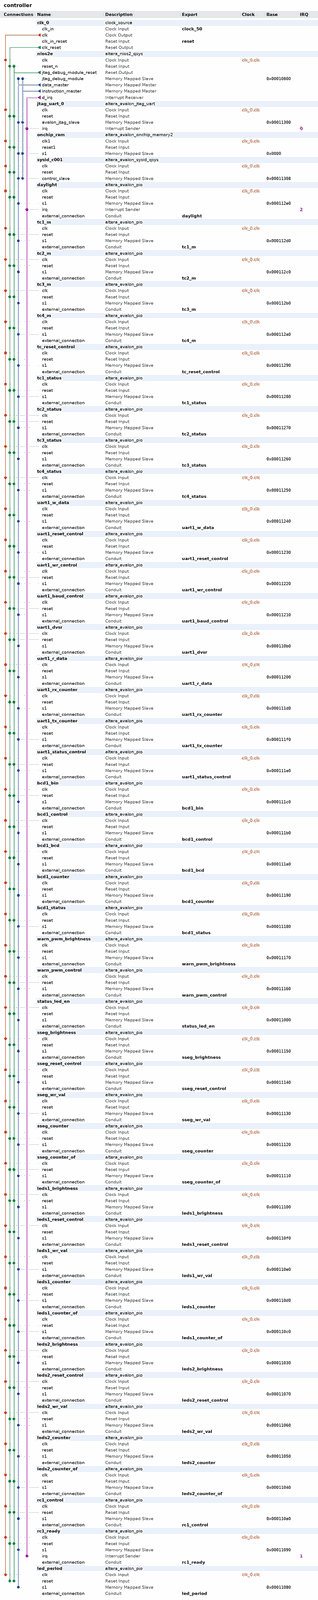
[diagram p0: system contents, whole]
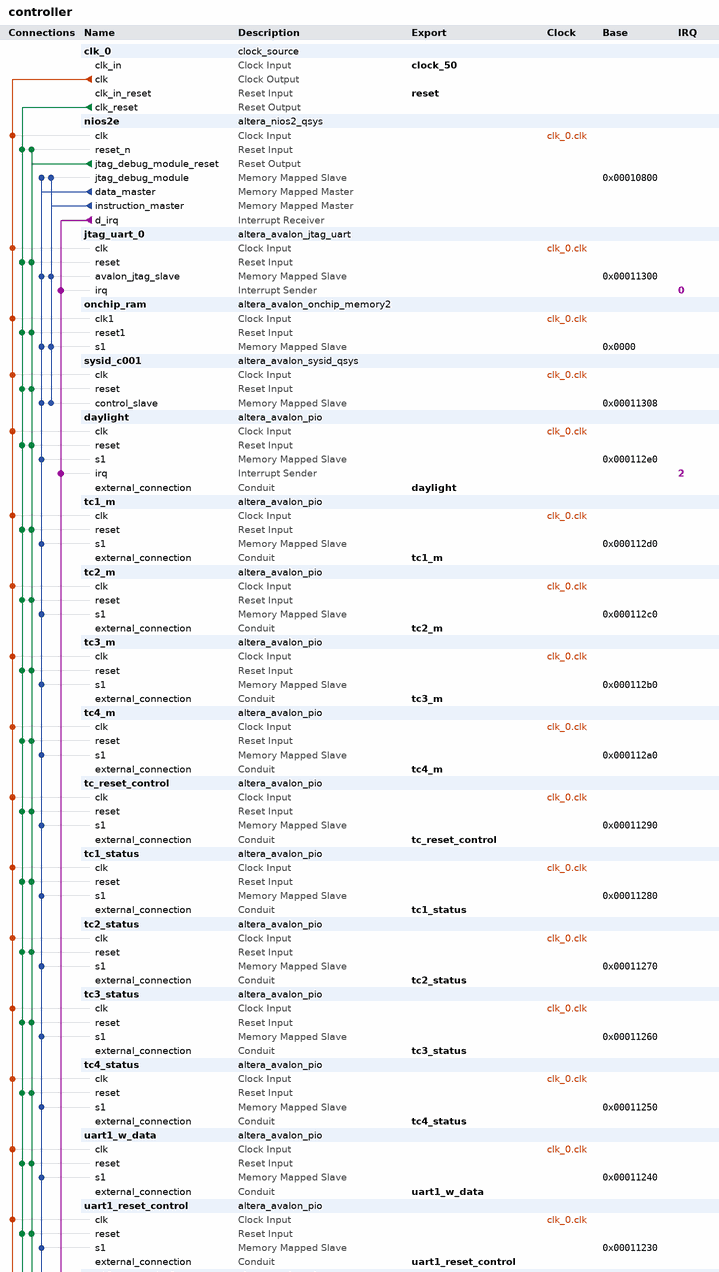
[diagram p1: system contents, upper part]
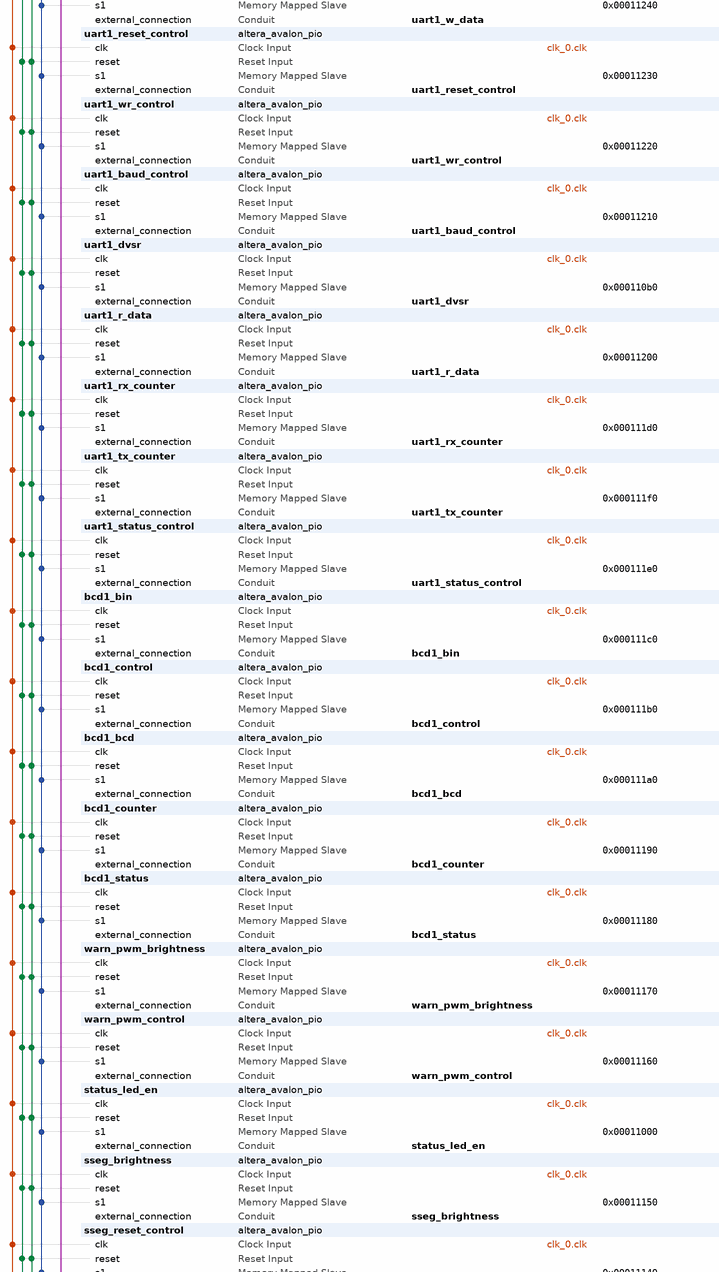
[diagram p2: system contents, middle part]
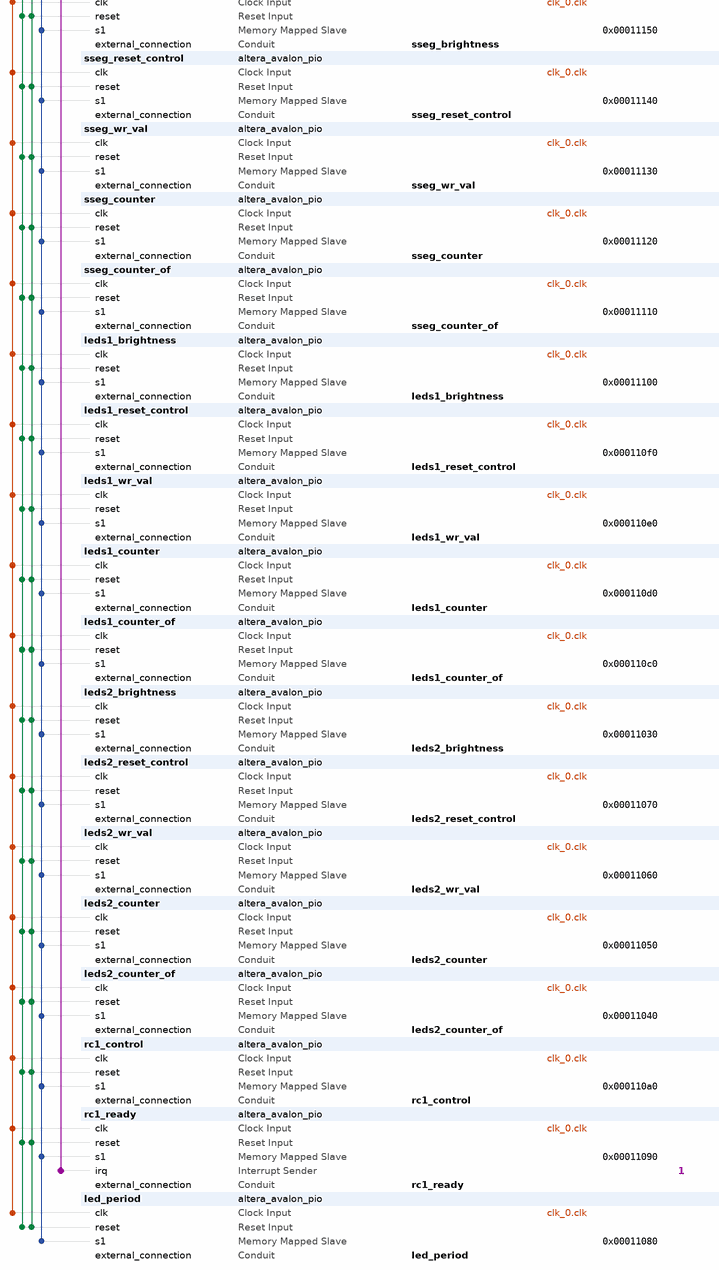
[diagram p3: system contents, lower part]
# Platform Designer (Qsys) system controller, Cyclone III EP3C16Q240C8
# Parameters at their usual value, and those the tool derives, are not listed.
package require -exact qsys 13.1
create_system controller
set_project_property DEVICE_FAMILY {Cyclone III}
set_project_property DEVICE EP3C16Q240C8

add_instance clk_0 clock_source 13.1
set_instance_parameter_value clk_0 clockFrequency 50000000

add_instance nios2e altera_nios2_qsys 13.1
set_instance_parameter_value nios2e setting_illegalInstructionsTrap true
set_instance_parameter_value nios2e muldiv_divider true
set_instance_parameter_value nios2e cpuID 49153
set_instance_parameter_value nios2e resetSlave Absolute
set_instance_parameter_value nios2e mmu_TLBMissExcSlave None
set_instance_parameter_value nios2e exceptionSlave Absolute
set_instance_parameter_value nios2e breakSlave nios2e.jtag_debug_module
set_instance_parameter_value nios2e impl Tiny
set_instance_parameter_value nios2e icache_size 512
set_instance_parameter_value nios2e icache_burstType Sequential

add_instance jtag_uart_0 altera_avalon_jtag_uart 13.1
set_instance_parameter_value jtag_uart_0 allowMultipleConnections true
set_instance_parameter_value jtag_uart_0 readBufferDepth 32
set_instance_parameter_value jtag_uart_0 simInteractiveOptions NO_INTERACTIVE_WINDOWS
set_instance_parameter_value jtag_uart_0 writeBufferDepth 256

add_instance onchip_ram altera_avalon_onchip_memory2 13.1
set_instance_parameter_value onchip_ram dataWidth 32
set_instance_parameter_value onchip_ram dualPort false
set_instance_parameter_value onchip_ram initMemContent true
set_instance_parameter_value onchip_ram initializationFileName "software\\controller\\mem_init\\controller_onchip_ram.hex"
set_instance_parameter_value onchip_ram memorySize 40000

add_instance sysid_c001 altera_avalon_sysid_qsys 13.1
set_instance_parameter_value sysid_c001 id 49153

add_instance daylight altera_avalon_pio 13.1
set_instance_parameter_value daylight captureEdge true
set_instance_parameter_value daylight direction Input
set_instance_parameter_value daylight generateIRQ true
set_instance_parameter_value daylight irqType EDGE
set_instance_parameter_value daylight simDoTestBenchWiring true
set_instance_parameter_value daylight width 1

add_instance tc1_m altera_avalon_pio 13.1
set_instance_parameter_value tc1_m direction Output
set_instance_parameter_value tc1_m width 32

add_instance tc2_m altera_avalon_pio 13.1
set_instance_parameter_value tc2_m direction Output
set_instance_parameter_value tc2_m width 32

add_instance tc3_m altera_avalon_pio 13.1
set_instance_parameter_value tc3_m direction Output
set_instance_parameter_value tc3_m width 32

add_instance tc4_m altera_avalon_pio 13.1
set_instance_parameter_value tc4_m direction Output
set_instance_parameter_value tc4_m width 32

add_instance tc_reset_control altera_avalon_pio 13.1
set_instance_parameter_value tc_reset_control direction Output
set_instance_parameter_value tc_reset_control resetValue 15
set_instance_parameter_value tc_reset_control width 4

add_instance tc1_status altera_avalon_pio 13.1
set_instance_parameter_value tc1_status direction Input
set_instance_parameter_value tc1_status simDoTestBenchWiring true
set_instance_parameter_value tc1_status width 25

add_instance tc2_status altera_avalon_pio 13.1
set_instance_parameter_value tc2_status direction Input
set_instance_parameter_value tc2_status simDoTestBenchWiring true
set_instance_parameter_value tc2_status width 25

add_instance tc3_status altera_avalon_pio 13.1
set_instance_parameter_value tc3_status direction Input
set_instance_parameter_value tc3_status simDoTestBenchWiring true
set_instance_parameter_value tc3_status width 25

add_instance tc4_status altera_avalon_pio 13.1
set_instance_parameter_value tc4_status direction Input
set_instance_parameter_value tc4_status simDoTestBenchWiring true
set_instance_parameter_value tc4_status width 25

add_instance uart1_w_data altera_avalon_pio 13.1
set_instance_parameter_value uart1_w_data direction Output
set_instance_parameter_value uart1_w_data width 8

add_instance uart1_reset_control altera_avalon_pio 13.1
set_instance_parameter_value uart1_reset_control direction Output
set_instance_parameter_value uart1_reset_control resetValue 7
set_instance_parameter_value uart1_reset_control width 3

add_instance uart1_wr_control altera_avalon_pio 13.1
set_instance_parameter_value uart1_wr_control direction Output
set_instance_parameter_value uart1_wr_control width 2

add_instance uart1_baud_control altera_avalon_pio 13.1
set_instance_parameter_value uart1_baud_control direction Output
set_instance_parameter_value uart1_baud_control width 22

add_instance uart1_dvsr altera_avalon_pio 13.1
set_instance_parameter_value uart1_dvsr direction Output
set_instance_parameter_value uart1_dvsr width 16

add_instance uart1_r_data altera_avalon_pio 13.1
set_instance_parameter_value uart1_r_data direction Input
set_instance_parameter_value uart1_r_data simDoTestBenchWiring true
set_instance_parameter_value uart1_r_data width 8

add_instance uart1_rx_counter altera_avalon_pio 13.1
set_instance_parameter_value uart1_rx_counter direction Input
set_instance_parameter_value uart1_rx_counter simDoTestBenchWiring true
set_instance_parameter_value uart1_rx_counter width 10

add_instance uart1_tx_counter altera_avalon_pio 13.1
set_instance_parameter_value uart1_tx_counter direction Input
set_instance_parameter_value uart1_tx_counter simDoTestBenchWiring true
set_instance_parameter_value uart1_tx_counter width 10

add_instance uart1_status_control altera_avalon_pio 13.1
set_instance_parameter_value uart1_status_control direction Input
set_instance_parameter_value uart1_status_control simDoTestBenchWiring true
set_instance_parameter_value uart1_status_control width 10

add_instance bcd1_bin altera_avalon_pio 13.1
set_instance_parameter_value bcd1_bin direction Output
set_instance_parameter_value bcd1_bin width 15

add_instance bcd1_control altera_avalon_pio 13.1
set_instance_parameter_value bcd1_control direction Output
set_instance_parameter_value bcd1_control resetValue 6
set_instance_parameter_value bcd1_control width 3

add_instance bcd1_bcd altera_avalon_pio 13.1
set_instance_parameter_value bcd1_bcd direction Input
set_instance_parameter_value bcd1_bcd simDoTestBenchWiring true
set_instance_parameter_value bcd1_bcd width 16

add_instance bcd1_counter altera_avalon_pio 13.1
set_instance_parameter_value bcd1_counter direction Input
set_instance_parameter_value bcd1_counter simDoTestBenchWiring true
set_instance_parameter_value bcd1_counter width 8

add_instance bcd1_status altera_avalon_pio 13.1
set_instance_parameter_value bcd1_status direction Input
set_instance_parameter_value bcd1_status simDoTestBenchWiring true
set_instance_parameter_value bcd1_status width 2

add_instance warn_pwm_brightness altera_avalon_pio 13.1
set_instance_parameter_value warn_pwm_brightness direction Output
set_instance_parameter_value warn_pwm_brightness width 8

add_instance warn_pwm_control altera_avalon_pio 13.1
set_instance_parameter_value warn_pwm_control direction Output
set_instance_parameter_value warn_pwm_control resetValue 2
set_instance_parameter_value warn_pwm_control width 2

add_instance status_led_en altera_avalon_pio 13.1
set_instance_parameter_value status_led_en bitModifyingOutReg true
set_instance_parameter_value status_led_en direction Output
set_instance_parameter_value status_led_en width 4

add_instance sseg_brightness altera_avalon_pio 13.1
set_instance_parameter_value sseg_brightness direction Output
set_instance_parameter_value sseg_brightness width 8

add_instance sseg_reset_control altera_avalon_pio 13.1
set_instance_parameter_value sseg_reset_control direction Output
set_instance_parameter_value sseg_reset_control resetValue 3
set_instance_parameter_value sseg_reset_control width 2

add_instance sseg_wr_val altera_avalon_pio 13.1
set_instance_parameter_value sseg_wr_val direction Output
set_instance_parameter_value sseg_wr_val width 13

add_instance sseg_counter altera_avalon_pio 13.1
set_instance_parameter_value sseg_counter direction Input
set_instance_parameter_value sseg_counter simDoTestBenchWiring true
set_instance_parameter_value sseg_counter width 8

add_instance sseg_counter_of altera_avalon_pio 13.1
set_instance_parameter_value sseg_counter_of direction Input
set_instance_parameter_value sseg_counter_of simDoTestBenchWiring true
set_instance_parameter_value sseg_counter_of width 1

add_instance leds1_brightness altera_avalon_pio 13.1
set_instance_parameter_value leds1_brightness direction Output
set_instance_parameter_value leds1_brightness width 8

add_instance leds1_reset_control altera_avalon_pio 13.1
set_instance_parameter_value leds1_reset_control direction Output
set_instance_parameter_value leds1_reset_control resetValue 3
set_instance_parameter_value leds1_reset_control width 2

add_instance leds1_wr_val altera_avalon_pio 13.1
set_instance_parameter_value leds1_wr_val direction Output
set_instance_parameter_value leds1_wr_val width 10

add_instance leds1_counter altera_avalon_pio 13.1
set_instance_parameter_value leds1_counter direction Input
set_instance_parameter_value leds1_counter simDoTestBenchWiring true
set_instance_parameter_value leds1_counter width 8

add_instance leds1_counter_of altera_avalon_pio 13.1
set_instance_parameter_value leds1_counter_of direction Input
set_instance_parameter_value leds1_counter_of simDoTestBenchWiring true
set_instance_parameter_value leds1_counter_of width 1

add_instance leds2_brightness altera_avalon_pio 13.1
set_instance_parameter_value leds2_brightness direction Output
set_instance_parameter_value leds2_brightness width 8

add_instance leds2_reset_control altera_avalon_pio 13.1
set_instance_parameter_value leds2_reset_control direction Output
set_instance_parameter_value leds2_reset_control resetValue 3
set_instance_parameter_value leds2_reset_control width 2

add_instance leds2_wr_val altera_avalon_pio 13.1
set_instance_parameter_value leds2_wr_val direction Output
set_instance_parameter_value leds2_wr_val width 10

add_instance leds2_counter altera_avalon_pio 13.1
set_instance_parameter_value leds2_counter direction Input
set_instance_parameter_value leds2_counter simDoTestBenchWiring true
set_instance_parameter_value leds2_counter width 8

add_instance leds2_counter_of altera_avalon_pio 13.1
set_instance_parameter_value leds2_counter_of direction Input
set_instance_parameter_value leds2_counter_of simDoTestBenchWiring true
set_instance_parameter_value leds2_counter_of width 1

add_instance rc1_control altera_avalon_pio 13.1
set_instance_parameter_value rc1_control direction Output
set_instance_parameter_value rc1_control width 25

add_instance rc1_ready altera_avalon_pio 13.1
set_instance_parameter_value rc1_ready captureEdge true
set_instance_parameter_value rc1_ready direction Input
set_instance_parameter_value rc1_ready generateIRQ true
set_instance_parameter_value rc1_ready irqType EDGE
set_instance_parameter_value rc1_ready simDoTestBenchWiring true
set_instance_parameter_value rc1_ready width 1

add_instance led_period altera_avalon_pio 13.1
set_instance_parameter_value led_period direction Output
set_instance_parameter_value led_period width 24

# connections
add_connection clk_0.clk bcd1_bcd.clk clock
add_connection clk_0.clk bcd1_bin.clk clock
add_connection clk_0.clk bcd1_control.clk clock
add_connection clk_0.clk bcd1_counter.clk clock
add_connection clk_0.clk bcd1_status.clk clock
add_connection clk_0.clk daylight.clk clock
add_connection clk_0.clk jtag_uart_0.clk clock
add_connection clk_0.clk led_period.clk clock
add_connection clk_0.clk leds1_brightness.clk clock
add_connection clk_0.clk leds1_counter.clk clock
add_connection clk_0.clk leds1_counter_of.clk clock
add_connection clk_0.clk leds1_reset_control.clk clock
add_connection clk_0.clk leds1_wr_val.clk clock
add_connection clk_0.clk leds2_brightness.clk clock
add_connection clk_0.clk leds2_counter.clk clock
add_connection clk_0.clk leds2_counter_of.clk clock
add_connection clk_0.clk leds2_reset_control.clk clock
add_connection clk_0.clk leds2_wr_val.clk clock
add_connection clk_0.clk nios2e.clk clock
add_connection clk_0.clk onchip_ram.clk1 clock
add_connection clk_0.clk rc1_control.clk clock
add_connection clk_0.clk rc1_ready.clk clock
add_connection clk_0.clk sseg_brightness.clk clock
add_connection clk_0.clk sseg_counter.clk clock
add_connection clk_0.clk sseg_counter_of.clk clock
add_connection clk_0.clk sseg_reset_control.clk clock
add_connection clk_0.clk sseg_wr_val.clk clock
add_connection clk_0.clk status_led_en.clk clock
add_connection clk_0.clk sysid_c001.clk clock
add_connection clk_0.clk tc1_m.clk clock
add_connection clk_0.clk tc1_status.clk clock
add_connection clk_0.clk tc2_m.clk clock
add_connection clk_0.clk tc2_status.clk clock
add_connection clk_0.clk tc3_m.clk clock
add_connection clk_0.clk tc3_status.clk clock
add_connection clk_0.clk tc4_m.clk clock
add_connection clk_0.clk tc4_status.clk clock
add_connection clk_0.clk tc_reset_control.clk clock
add_connection clk_0.clk uart1_baud_control.clk clock
add_connection clk_0.clk uart1_dvsr.clk clock
add_connection clk_0.clk uart1_r_data.clk clock
add_connection clk_0.clk uart1_reset_control.clk clock
add_connection clk_0.clk uart1_rx_counter.clk clock
add_connection clk_0.clk uart1_status_control.clk clock
add_connection clk_0.clk uart1_tx_counter.clk clock
add_connection clk_0.clk uart1_w_data.clk clock
add_connection clk_0.clk uart1_wr_control.clk clock
add_connection clk_0.clk warn_pwm_brightness.clk clock
add_connection clk_0.clk warn_pwm_control.clk clock
add_connection clk_0.clk_reset bcd1_bcd.reset reset
add_connection clk_0.clk_reset bcd1_bin.reset reset
add_connection clk_0.clk_reset bcd1_control.reset reset
add_connection clk_0.clk_reset bcd1_counter.reset reset
add_connection clk_0.clk_reset bcd1_status.reset reset
add_connection clk_0.clk_reset daylight.reset reset
add_connection clk_0.clk_reset jtag_uart_0.reset reset
add_connection clk_0.clk_reset led_period.reset reset
add_connection clk_0.clk_reset leds1_brightness.reset reset
add_connection clk_0.clk_reset leds1_counter.reset reset
add_connection clk_0.clk_reset leds1_counter_of.reset reset
add_connection clk_0.clk_reset leds1_reset_control.reset reset
add_connection clk_0.clk_reset leds1_wr_val.reset reset
add_connection clk_0.clk_reset leds2_brightness.reset reset
add_connection clk_0.clk_reset leds2_counter.reset reset
add_connection clk_0.clk_reset leds2_counter_of.reset reset
add_connection clk_0.clk_reset leds2_reset_control.reset reset
add_connection clk_0.clk_reset leds2_wr_val.reset reset
add_connection clk_0.clk_reset nios2e.reset_n reset
add_connection clk_0.clk_reset onchip_ram.reset1 reset
add_connection clk_0.clk_reset rc1_control.reset reset
add_connection clk_0.clk_reset rc1_ready.reset reset
add_connection clk_0.clk_reset sseg_brightness.reset reset
add_connection clk_0.clk_reset sseg_counter.reset reset
add_connection clk_0.clk_reset sseg_counter_of.reset reset
add_connection clk_0.clk_reset sseg_reset_control.reset reset
add_connection clk_0.clk_reset sseg_wr_val.reset reset
add_connection clk_0.clk_reset status_led_en.reset reset
add_connection clk_0.clk_reset sysid_c001.reset reset
add_connection clk_0.clk_reset tc1_m.reset reset
add_connection clk_0.clk_reset tc1_status.reset reset
add_connection clk_0.clk_reset tc2_m.reset reset
add_connection clk_0.clk_reset tc2_status.reset reset
add_connection clk_0.clk_reset tc3_m.reset reset
add_connection clk_0.clk_reset tc3_status.reset reset
add_connection clk_0.clk_reset tc4_m.reset reset
add_connection clk_0.clk_reset tc4_status.reset reset
add_connection clk_0.clk_reset tc_reset_control.reset reset
add_connection clk_0.clk_reset uart1_baud_control.reset reset
add_connection clk_0.clk_reset uart1_dvsr.reset reset
add_connection clk_0.clk_reset uart1_r_data.reset reset
add_connection clk_0.clk_reset uart1_reset_control.reset reset
add_connection clk_0.clk_reset uart1_rx_counter.reset reset
add_connection clk_0.clk_reset uart1_status_control.reset reset
add_connection clk_0.clk_reset uart1_tx_counter.reset reset
add_connection clk_0.clk_reset uart1_w_data.reset reset
add_connection clk_0.clk_reset uart1_wr_control.reset reset
add_connection clk_0.clk_reset warn_pwm_brightness.reset reset
add_connection clk_0.clk_reset warn_pwm_control.reset reset
add_connection nios2e.jtag_debug_module_reset bcd1_bcd.reset reset
add_connection nios2e.jtag_debug_module_reset bcd1_bin.reset reset
add_connection nios2e.jtag_debug_module_reset bcd1_control.reset reset
add_connection nios2e.jtag_debug_module_reset bcd1_counter.reset reset
add_connection nios2e.jtag_debug_module_reset bcd1_status.reset reset
add_connection nios2e.jtag_debug_module_reset daylight.reset reset
add_connection nios2e.jtag_debug_module_reset jtag_uart_0.reset reset
add_connection nios2e.jtag_debug_module_reset led_period.reset reset
add_connection nios2e.jtag_debug_module_reset leds1_brightness.reset reset
add_connection nios2e.jtag_debug_module_reset leds1_counter.reset reset
add_connection nios2e.jtag_debug_module_reset leds1_counter_of.reset reset
add_connection nios2e.jtag_debug_module_reset leds1_reset_control.reset reset
add_connection nios2e.jtag_debug_module_reset leds1_wr_val.reset reset
add_connection nios2e.jtag_debug_module_reset leds2_brightness.reset reset
add_connection nios2e.jtag_debug_module_reset leds2_counter.reset reset
add_connection nios2e.jtag_debug_module_reset leds2_counter_of.reset reset
add_connection nios2e.jtag_debug_module_reset leds2_reset_control.reset reset
add_connection nios2e.jtag_debug_module_reset leds2_wr_val.reset reset
add_connection nios2e.jtag_debug_module_reset nios2e.reset_n reset
add_connection nios2e.jtag_debug_module_reset onchip_ram.reset1 reset
add_connection nios2e.jtag_debug_module_reset rc1_control.reset reset
add_connection nios2e.jtag_debug_module_reset rc1_ready.reset reset
add_connection nios2e.jtag_debug_module_reset sseg_brightness.reset reset
add_connection nios2e.jtag_debug_module_reset sseg_counter.reset reset
add_connection nios2e.jtag_debug_module_reset sseg_counter_of.reset reset
add_connection nios2e.jtag_debug_module_reset sseg_reset_control.reset reset
add_connection nios2e.jtag_debug_module_reset sseg_wr_val.reset reset
add_connection nios2e.jtag_debug_module_reset status_led_en.reset reset
add_connection nios2e.jtag_debug_module_reset sysid_c001.reset reset
add_connection nios2e.jtag_debug_module_reset tc1_m.reset reset
add_connection nios2e.jtag_debug_module_reset tc1_status.reset reset
add_connection nios2e.jtag_debug_module_reset tc2_m.reset reset
add_connection nios2e.jtag_debug_module_reset tc2_status.reset reset
add_connection nios2e.jtag_debug_module_reset tc3_m.reset reset
add_connection nios2e.jtag_debug_module_reset tc3_status.reset reset
add_connection nios2e.jtag_debug_module_reset tc4_m.reset reset
add_connection nios2e.jtag_debug_module_reset tc4_status.reset reset
add_connection nios2e.jtag_debug_module_reset tc_reset_control.reset reset
add_connection nios2e.jtag_debug_module_reset uart1_baud_control.reset reset
add_connection nios2e.jtag_debug_module_reset uart1_dvsr.reset reset
add_connection nios2e.jtag_debug_module_reset uart1_r_data.reset reset
add_connection nios2e.jtag_debug_module_reset uart1_reset_control.reset reset
add_connection nios2e.jtag_debug_module_reset uart1_rx_counter.reset reset
add_connection nios2e.jtag_debug_module_reset uart1_status_control.reset reset
add_connection nios2e.jtag_debug_module_reset uart1_tx_counter.reset reset
add_connection nios2e.jtag_debug_module_reset uart1_w_data.reset reset
add_connection nios2e.jtag_debug_module_reset uart1_wr_control.reset reset
add_connection nios2e.jtag_debug_module_reset warn_pwm_brightness.reset reset
add_connection nios2e.jtag_debug_module_reset warn_pwm_control.reset reset
add_connection nios2e.data_master bcd1_bcd.s1 avalon
set_connection_parameter_value nios2e.data_master/bcd1_bcd.s1 baseAddress 0x000111a0
add_connection nios2e.data_master bcd1_bin.s1 avalon
set_connection_parameter_value nios2e.data_master/bcd1_bin.s1 baseAddress 0x000111c0
add_connection nios2e.data_master bcd1_control.s1 avalon
set_connection_parameter_value nios2e.data_master/bcd1_control.s1 baseAddress 0x000111b0
add_connection nios2e.data_master bcd1_counter.s1 avalon
set_connection_parameter_value nios2e.data_master/bcd1_counter.s1 baseAddress 0x00011190
add_connection nios2e.data_master bcd1_status.s1 avalon
set_connection_parameter_value nios2e.data_master/bcd1_status.s1 baseAddress 0x00011180
add_connection nios2e.data_master daylight.s1 avalon
set_connection_parameter_value nios2e.data_master/daylight.s1 baseAddress 0x000112e0
add_connection nios2e.data_master jtag_uart_0.avalon_jtag_slave avalon
set_connection_parameter_value nios2e.data_master/jtag_uart_0.avalon_jtag_slave baseAddress 0x00011300
add_connection nios2e.data_master led_period.s1 avalon
set_connection_parameter_value nios2e.data_master/led_period.s1 baseAddress 0x00011080
add_connection nios2e.data_master leds1_brightness.s1 avalon
set_connection_parameter_value nios2e.data_master/leds1_brightness.s1 baseAddress 0x00011100
add_connection nios2e.data_master leds1_counter.s1 avalon
set_connection_parameter_value nios2e.data_master/leds1_counter.s1 baseAddress 0x000110d0
add_connection nios2e.data_master leds1_counter_of.s1 avalon
set_connection_parameter_value nios2e.data_master/leds1_counter_of.s1 baseAddress 0x000110c0
add_connection nios2e.data_master leds1_reset_control.s1 avalon
set_connection_parameter_value nios2e.data_master/leds1_reset_control.s1 baseAddress 0x000110f0
add_connection nios2e.data_master leds1_wr_val.s1 avalon
set_connection_parameter_value nios2e.data_master/leds1_wr_val.s1 baseAddress 0x000110e0
add_connection nios2e.data_master leds2_brightness.s1 avalon
set_connection_parameter_value nios2e.data_master/leds2_brightness.s1 baseAddress 0x00011030
add_connection nios2e.data_master leds2_counter.s1 avalon
set_connection_parameter_value nios2e.data_master/leds2_counter.s1 baseAddress 0x00011050
add_connection nios2e.data_master leds2_counter_of.s1 avalon
set_connection_parameter_value nios2e.data_master/leds2_counter_of.s1 baseAddress 0x00011040
add_connection nios2e.data_master leds2_reset_control.s1 avalon
set_connection_parameter_value nios2e.data_master/leds2_reset_control.s1 baseAddress 0x00011070
add_connection nios2e.data_master leds2_wr_val.s1 avalon
set_connection_parameter_value nios2e.data_master/leds2_wr_val.s1 baseAddress 0x00011060
add_connection nios2e.data_master nios2e.jtag_debug_module avalon
set_connection_parameter_value nios2e.data_master/nios2e.jtag_debug_module baseAddress 0x00010800
add_connection nios2e.data_master onchip_ram.s1 avalon
set_connection_parameter_value nios2e.data_master/onchip_ram.s1 baseAddress 0x0000
add_connection nios2e.data_master rc1_control.s1 avalon
set_connection_parameter_value nios2e.data_master/rc1_control.s1 baseAddress 0x000110a0
add_connection nios2e.data_master rc1_ready.s1 avalon
set_connection_parameter_value nios2e.data_master/rc1_ready.s1 baseAddress 0x00011090
add_connection nios2e.data_master sseg_brightness.s1 avalon
set_connection_parameter_value nios2e.data_master/sseg_brightness.s1 baseAddress 0x00011150
add_connection nios2e.data_master sseg_counter.s1 avalon
set_connection_parameter_value nios2e.data_master/sseg_counter.s1 baseAddress 0x00011120
add_connection nios2e.data_master sseg_counter_of.s1 avalon
set_connection_parameter_value nios2e.data_master/sseg_counter_of.s1 baseAddress 0x00011110
add_connection nios2e.data_master sseg_reset_control.s1 avalon
set_connection_parameter_value nios2e.data_master/sseg_reset_control.s1 baseAddress 0x00011140
add_connection nios2e.data_master sseg_wr_val.s1 avalon
set_connection_parameter_value nios2e.data_master/sseg_wr_val.s1 baseAddress 0x00011130
add_connection nios2e.data_master status_led_en.s1 avalon
set_connection_parameter_value nios2e.data_master/status_led_en.s1 baseAddress 0x00011000
add_connection nios2e.data_master sysid_c001.control_slave avalon
set_connection_parameter_value nios2e.data_master/sysid_c001.control_slave baseAddress 0x00011308
add_connection nios2e.data_master tc1_m.s1 avalon
set_connection_parameter_value nios2e.data_master/tc1_m.s1 baseAddress 0x000112d0
add_connection nios2e.data_master tc1_status.s1 avalon
set_connection_parameter_value nios2e.data_master/tc1_status.s1 baseAddress 0x00011280
add_connection nios2e.data_master tc2_m.s1 avalon
set_connection_parameter_value nios2e.data_master/tc2_m.s1 baseAddress 0x000112c0
add_connection nios2e.data_master tc2_status.s1 avalon
set_connection_parameter_value nios2e.data_master/tc2_status.s1 baseAddress 0x00011270
add_connection nios2e.data_master tc3_m.s1 avalon
set_connection_parameter_value nios2e.data_master/tc3_m.s1 baseAddress 0x000112b0
add_connection nios2e.data_master tc3_status.s1 avalon
set_connection_parameter_value nios2e.data_master/tc3_status.s1 baseAddress 0x00011260
add_connection nios2e.data_master tc4_m.s1 avalon
set_connection_parameter_value nios2e.data_master/tc4_m.s1 baseAddress 0x000112a0
add_connection nios2e.data_master tc4_status.s1 avalon
set_connection_parameter_value nios2e.data_master/tc4_status.s1 baseAddress 0x00011250
add_connection nios2e.data_master tc_reset_control.s1 avalon
set_connection_parameter_value nios2e.data_master/tc_reset_control.s1 baseAddress 0x00011290
add_connection nios2e.data_master uart1_baud_control.s1 avalon
set_connection_parameter_value nios2e.data_master/uart1_baud_control.s1 baseAddress 0x00011210
add_connection nios2e.data_master uart1_dvsr.s1 avalon
set_connection_parameter_value nios2e.data_master/uart1_dvsr.s1 baseAddress 0x000110b0
add_connection nios2e.data_master uart1_r_data.s1 avalon
set_connection_parameter_value nios2e.data_master/uart1_r_data.s1 baseAddress 0x00011200
add_connection nios2e.data_master uart1_reset_control.s1 avalon
set_connection_parameter_value nios2e.data_master/uart1_reset_control.s1 baseAddress 0x00011230
add_connection nios2e.data_master uart1_rx_counter.s1 avalon
set_connection_parameter_value nios2e.data_master/uart1_rx_counter.s1 baseAddress 0x000111d0
add_connection nios2e.data_master uart1_status_control.s1 avalon
set_connection_parameter_value nios2e.data_master/uart1_status_control.s1 baseAddress 0x000111e0
add_connection nios2e.data_master uart1_tx_counter.s1 avalon
set_connection_parameter_value nios2e.data_master/uart1_tx_counter.s1 baseAddress 0x000111f0
add_connection nios2e.data_master uart1_w_data.s1 avalon
set_connection_parameter_value nios2e.data_master/uart1_w_data.s1 baseAddress 0x00011240
add_connection nios2e.data_master uart1_wr_control.s1 avalon
set_connection_parameter_value nios2e.data_master/uart1_wr_control.s1 baseAddress 0x00011220
add_connection nios2e.data_master warn_pwm_brightness.s1 avalon
set_connection_parameter_value nios2e.data_master/warn_pwm_brightness.s1 baseAddress 0x00011170
add_connection nios2e.data_master warn_pwm_control.s1 avalon
set_connection_parameter_value nios2e.data_master/warn_pwm_control.s1 baseAddress 0x00011160
add_connection nios2e.instruction_master jtag_uart_0.avalon_jtag_slave avalon
set_connection_parameter_value nios2e.instruction_master/jtag_uart_0.avalon_jtag_slave baseAddress 0x00011300
add_connection nios2e.instruction_master nios2e.jtag_debug_module avalon
set_connection_parameter_value nios2e.instruction_master/nios2e.jtag_debug_module baseAddress 0x00010800
add_connection nios2e.instruction_master onchip_ram.s1 avalon
set_connection_parameter_value nios2e.instruction_master/onchip_ram.s1 baseAddress 0x0000
add_connection nios2e.instruction_master sysid_c001.control_slave avalon
set_connection_parameter_value nios2e.instruction_master/sysid_c001.control_slave baseAddress 0x00011308
add_connection nios2e.d_irq daylight.irq interrupt
set_connection_parameter_value nios2e.d_irq/daylight.irq irqNumber 2
add_connection nios2e.d_irq jtag_uart_0.irq interrupt
set_connection_parameter_value nios2e.d_irq/jtag_uart_0.irq irqNumber 0
add_connection nios2e.d_irq rc1_ready.irq interrupt
set_connection_parameter_value nios2e.d_irq/rc1_ready.irq irqNumber 1

# exported interfaces
add_interface clock_50 clock sink
set_interface_property clock_50 EXPORT_OF clk_0.clk_in
add_interface daylight conduit end
set_interface_property daylight EXPORT_OF daylight.external_connection
add_interface tc1_m conduit end
set_interface_property tc1_m EXPORT_OF tc1_m.external_connection
add_interface tc2_m conduit end
set_interface_property tc2_m EXPORT_OF tc2_m.external_connection
add_interface tc3_m conduit end
set_interface_property tc3_m EXPORT_OF tc3_m.external_connection
add_interface tc4_m conduit end
set_interface_property tc4_m EXPORT_OF tc4_m.external_connection
add_interface tc_reset_control conduit end
set_interface_property tc_reset_control EXPORT_OF tc_reset_control.external_connection
add_interface tc1_status conduit end
set_interface_property tc1_status EXPORT_OF tc1_status.external_connection
add_interface tc2_status conduit end
set_interface_property tc2_status EXPORT_OF tc2_status.external_connection
add_interface tc3_status conduit end
set_interface_property tc3_status EXPORT_OF tc3_status.external_connection
add_interface tc4_status conduit end
set_interface_property tc4_status EXPORT_OF tc4_status.external_connection
add_interface uart1_w_data conduit end
set_interface_property uart1_w_data EXPORT_OF uart1_w_data.external_connection
add_interface uart1_reset_control conduit end
set_interface_property uart1_reset_control EXPORT_OF uart1_reset_control.external_connection
add_interface uart1_wr_control conduit end
set_interface_property uart1_wr_control EXPORT_OF uart1_wr_control.external_connection
add_interface uart1_baud_control conduit end
set_interface_property uart1_baud_control EXPORT_OF uart1_baud_control.external_connection
add_interface uart1_r_data conduit end
set_interface_property uart1_r_data EXPORT_OF uart1_r_data.external_connection
add_interface uart1_rx_counter conduit end
set_interface_property uart1_rx_counter EXPORT_OF uart1_rx_counter.external_connection
add_interface uart1_tx_counter conduit end
set_interface_property uart1_tx_counter EXPORT_OF uart1_tx_counter.external_connection
add_interface uart1_status_control conduit end
set_interface_property uart1_status_control EXPORT_OF uart1_status_control.external_connection
add_interface bcd1_bin conduit end
set_interface_property bcd1_bin EXPORT_OF bcd1_bin.external_connection
add_interface bcd1_control conduit end
set_interface_property bcd1_control EXPORT_OF bcd1_control.external_connection
add_interface bcd1_bcd conduit end
set_interface_property bcd1_bcd EXPORT_OF bcd1_bcd.external_connection
add_interface bcd1_counter conduit end
set_interface_property bcd1_counter EXPORT_OF bcd1_counter.external_connection
add_interface bcd1_status conduit end
set_interface_property bcd1_status EXPORT_OF bcd1_status.external_connection
add_interface warn_pwm_brightness conduit end
set_interface_property warn_pwm_brightness EXPORT_OF warn_pwm_brightness.external_connection
add_interface status_led_en conduit end
set_interface_property status_led_en EXPORT_OF status_led_en.external_connection
add_interface warn_pwm_control conduit end
set_interface_property warn_pwm_control EXPORT_OF warn_pwm_control.external_connection
add_interface sseg_brightness conduit end
set_interface_property sseg_brightness EXPORT_OF sseg_brightness.external_connection
add_interface sseg_reset_control conduit end
set_interface_property sseg_reset_control EXPORT_OF sseg_reset_control.external_connection
add_interface sseg_wr_val conduit end
set_interface_property sseg_wr_val EXPORT_OF sseg_wr_val.external_connection
add_interface sseg_counter conduit end
set_interface_property sseg_counter EXPORT_OF sseg_counter.external_connection
add_interface sseg_counter_of conduit end
set_interface_property sseg_counter_of EXPORT_OF sseg_counter_of.external_connection
add_interface leds1_brightness conduit end
set_interface_property leds1_brightness EXPORT_OF leds1_brightness.external_connection
add_interface leds1_wr_val conduit end
set_interface_property leds1_wr_val EXPORT_OF leds1_wr_val.external_connection
add_interface leds1_counter conduit end
set_interface_property leds1_counter EXPORT_OF leds1_counter.external_connection
add_interface leds1_reset_control conduit end
set_interface_property leds1_reset_control EXPORT_OF leds1_reset_control.external_connection
add_interface leds1_counter_of conduit end
set_interface_property leds1_counter_of EXPORT_OF leds1_counter_of.external_connection
add_interface reset reset sink
set_interface_property reset EXPORT_OF clk_0.clk_in_reset
add_interface uart1_dvsr conduit end
set_interface_property uart1_dvsr EXPORT_OF uart1_dvsr.external_connection
add_interface rc1_control conduit end
set_interface_property rc1_control EXPORT_OF rc1_control.external_connection
add_interface rc1_ready conduit end
set_interface_property rc1_ready EXPORT_OF rc1_ready.external_connection
add_interface led_period conduit end
set_interface_property led_period EXPORT_OF led_period.external_connection
add_interface leds2_reset_control conduit end
set_interface_property leds2_reset_control EXPORT_OF leds2_reset_control.external_connection
add_interface leds2_wr_val conduit end
set_interface_property leds2_wr_val EXPORT_OF leds2_wr_val.external_connection
add_interface leds2_counter conduit end
set_interface_property leds2_counter EXPORT_OF leds2_counter.external_connection
add_interface leds2_counter_of conduit end
set_interface_property leds2_counter_of EXPORT_OF leds2_counter_of.external_connection
add_interface leds2_brightness conduit end
set_interface_property leds2_brightness EXPORT_OF leds2_brightness.external_connection

set_interconnect_requirement {$system} qsys_mm.clockCrossingAdapter HANDSHAKE
set_interconnect_requirement {$system} qsys_mm.maxAdditionalLatency 1
set_interconnect_requirement {$system} qsys_mm.insertDefaultSlave false

save_system controller.qsys
